# Altium schematic sheet PAGE06_握手协议飞机端.SchDoc
size A4
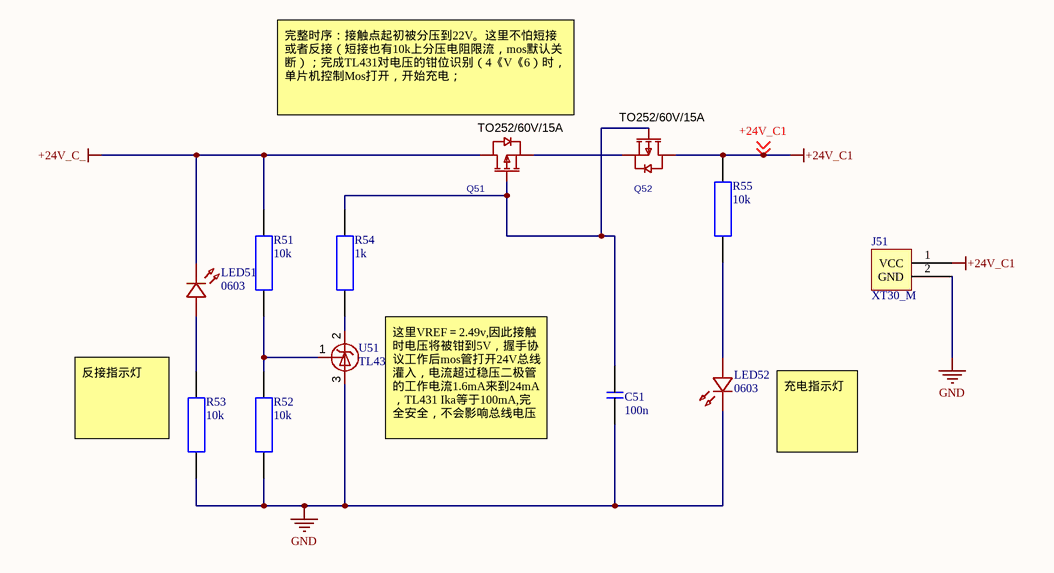
[diagram p0: PAGE06_握手协议飞机端.SchDoc]

## Parts
C51  100n  [0603_ding_C]
J51  XT30_M  [XT30（立式）]
LED51  0603  [LED0603-RD_GREEN]
LED52  0603  [LED0603-RD_GREEN]
Q51  TO252/60V/15A  [TO-252-2_L6.6-W6.1-P4.57-LS9.9-BR-CW]
Q52  TO252/60V/15A  [TO-252-2_L6.6-W6.1-P4.57-LS9.9-BR-CW]
R51  10k  [0603_ding_R]
R52  10k  [0603_ding_R]
R53  10k  [0603_ding_R]
R54  1k  [0603_ding_R]
R55  10k  [0603_ding_R]
U51  TL431  [SOT-23-3_L3.0-W1.6-P1.90-LS2.8-BR]

## Nets
+24V_C1: J51.1(VCC) Q52.2(D) R55.1 ; off-sheet +24V_C1
+24V_C_: LED51.1(C) Q51.2(D) R51.2
GND: C51.1 J51.2(GND) LED52.1(C) R52.1 R53.1 U51.3(A)
NetC51_2: C51.2 Q51.1(G) Q52.1(G) R54.2
NetLED51_2: LED51.2(A) R53.2
NetLED52_2: LED52.2(A) R55.2
NetQ51_3: Q51.3(S) Q52.3(S)
NetR51_1: R51.1 R52.2 U51.1(R)
NetR54_1: R54.1 U51.2(K)

## Notes on the sheet
- (near Q51) 完整时序：接触点起初被分压到22V。这里不怕短接或者反接（短接也有10k上分压电阻限流，mos默认关断）；完成TL431对电压的钳位识别（4《V《6）时，单片机控制Mos打开，开始充电；
- (near R53) 反接指示灯
- 这里VREF＝2.49v,因此接触时电压将被钳到5V，握手协议工作后mos管打开24V总线灌入，电流超过稳压二极管的工作电流1.6mA来到24mA，TL431 Ika等于100mA,完全安全，不会影响总线电压
- 充电指示灯

## Library data of the parts
C51 = C
LED51 LED52 = LED0603
Q51 Q52 = aod4185_c400894: 数量:1个P沟道;漏源电压(Vdss):40V;连续漏极电流(Id):40A;导通电阻(RDS(on)):15mΩ@10V;耗散功率(Pd):62.5W;阈值电压(Vgs(th)):3V;; Manufacturer: AOS; AddInBom: yes; ModelId: dee852f3c6b348a2b9d5be5dd3244081; ModelName: TO-252-3_L6.6-W6.1-P4.57-LS9.9-BR-CW; ModelTransform: 258.97184,390.1567,0,90,0,0,-35.433,0,0; Number: 1个P沟道; Drain to Source Voltage: 40V; Current - Continuous Drain(Id): 40A; Pd - Power Dissipation: 62.5W; Gate Threshold Voltage (Vgs(th)): 3V; Gate Charge(Qg): 55nC@10V; Input Capacitance(Ciss): 2.55nF; Reverse Transfer Capacitance (Crss@Vds): 190pF; Type: P沟道; Output Capacitance(Coss): 280pF; Vgs: ±20V; Symbol: AOD4185_C400894; LCSC Part Name: 1个P沟道 耐压:40V 电流:40A; SupplierPart: C400894; ManufacturerPart: AOD4185; Supplier Footprint: TO-252(DPAK); JLCPCB Part Class: Extended Part; Datasheet: https://item.szlcsc.com/datasheet/AOD4185/385415.html; Supplier: LCSC; ConvertToPcb: yes; FootprintName: TO-252-3_L6.6-W6.1-P4.57-LS9.9-BR-CW; RDS(on): 15mΩ@10V; Operating Temperature: -55℃~+175℃; Configuration: -
R51-R55 = RES